# EAGLE design MidiMon_v3 (EAGLE 9.3.0)
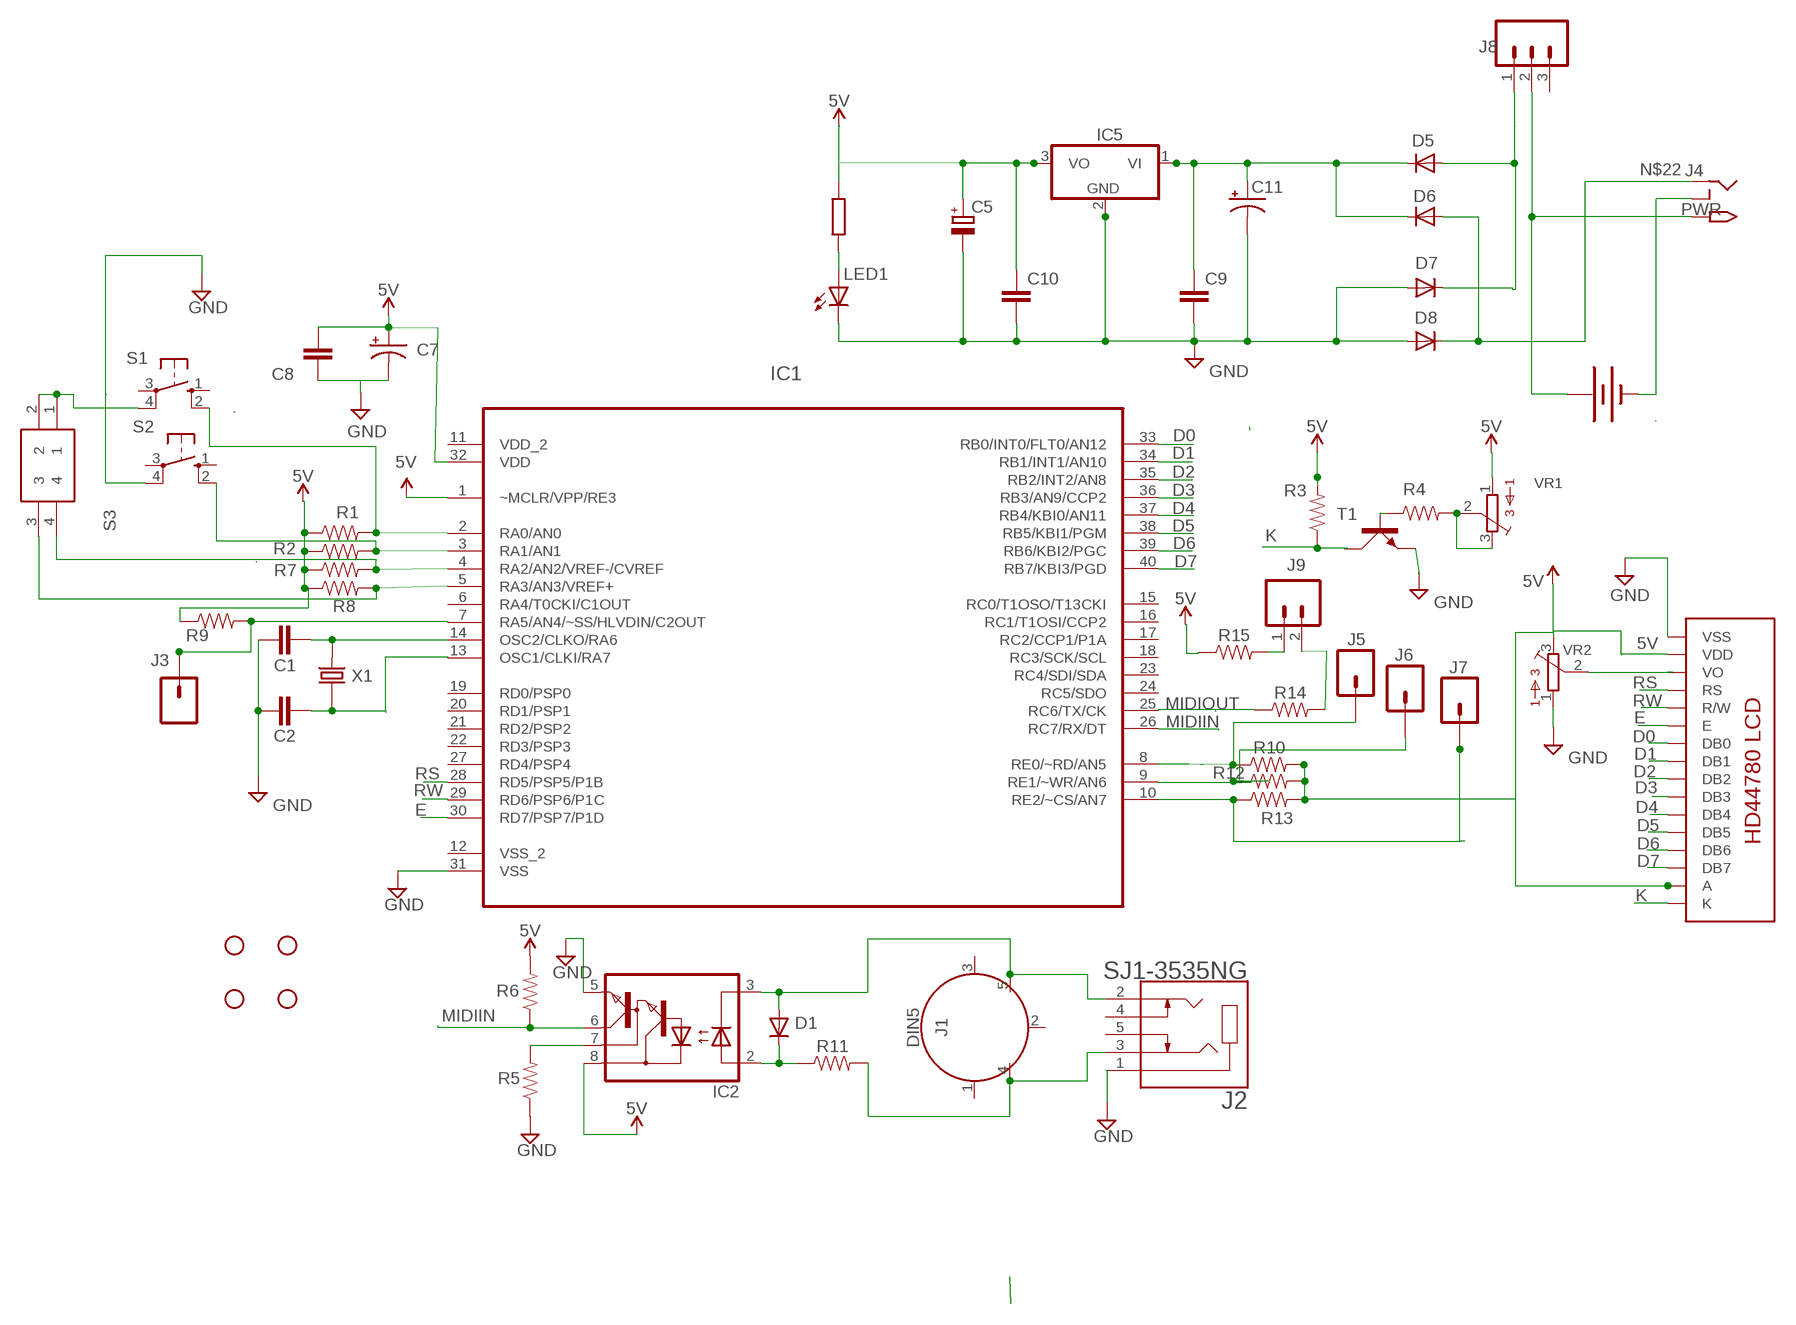
[diagram p0: schematic, sheet 1]

## Parts
BAT1  BATTERY  [PP3_BATTERBOX]
C1  33pF  22PF-PTH-2.54MM-200V-5%  [CAP-PTH-2.54]
C2  33pF  22PF-PTH-2.54MM-200V-5%  [CAP-PTH-2.54]
C5  10uf  CPOL-EUE2.5-7  [E2,5-7]
C7  10uF  10UF-POLAR-RADIAL-2.5MM-25V-20%  [CPOL-RADIAL-2.5MM-5MM]
C8  0.1uF  C-EU025-024X044  [C025-024X044]
C9  330nf  C-EU025-024X044  [C025-024X044]
C10  100nf  C-EU025-024X044  [C025-024X044]
C11  2200uf  CPOL-USE5-10.5  [E5-10,5]
D1  DIODEDO-1N4148  [DO-1N4148]
D5  1N4004  [DO-VERT]
D6  1N4004  [DO-VERT]
D7  1N4004  [DO-VERT]
D8  1N4004  [DO-VERT]
H1  STAND-OFFTIGHT  [STAND-OFF-TIGHT]
H2  STAND-OFFTIGHT  [STAND-OFF-TIGHT]
H3  STAND-OFFTIGHT  [STAND-OFF-TIGHT]
H4  STAND-OFFTIGHT  [STAND-OFF-TIGHT]
IC1  PIC18F4520-I/P  [DIP254P1524X533-40]
IC2  6N138  [DIL08]
IC5  7805TV  [TO220V]
J1  DIN5  [DIN5-RA-PTH]
J2  SJ1-3535NG  [CUI_SJ1-3535NG]
J3  CONN_01  [1X01]
J4  2.1MMJACKTHM  [PJ-102A]
J5  CONN_01  [1X01]
J6  CONN_01  [1X01]
J7  CONN_01  [1X01]
J8  CONN_03  [1X03]
J9  CONN_02  [1X02]
LED1  LED3MM  [LED3MM]
R1  10k  1KOHM-HORIZ-1/4W-5%  [AXIAL-0.3]
R2  10k  1KOHM-HORIZ-1/4W-5%  [AXIAL-0.3]
R3  10k  1KOHM-HORIZ-1/4W-5%  [AXIAL-0.3]
R4  1k  1KOHM-HORIZ-1/4W-5%  [AXIAL-0.3]
R5  5.6k  1KOHM-HORIZ-1/4W-5%  [AXIAL-0.3]
R6  1.2k  1KOHM-HORIZ-1/4W-5%  [AXIAL-0.3]
R7  10k  1KOHM-HORIZ-1/4W-5%  [AXIAL-0.3]
R8  10k  1KOHM-HORIZ-1/4W-5%  [AXIAL-0.3]
R9  10k  1KOHM-HORIZ-1/4W-5%  [AXIAL-0.3]
R10  10k  1KOHM-HORIZ-1/4W-5%  [AXIAL-0.3]
R11  220  1KOHM-HORIZ-1/4W-5%  [AXIAL-0.3]
R12  10k  1KOHM-HORIZ-1/4W-5%  [AXIAL-0.3]
R13  10k  1KOHM-HORIZ-1/4W-5%  [AXIAL-0.3]
R14  220  1KOHM-HORIZ-1/4W-5%  [AXIAL-0.3]
R15  220  1KOHM-HORIZ-1/4W-5%  [AXIAL-0.3]
R20  1k  R-EU_0207/7  [0207/7]
S1  40-XX  [B3F-40XX]
S2  40-XX  [B3F-40XX]
S3  195-2MST  [DIPS774W56P254L726H790Q4N]
T1  2N3904  [TO92D]
U$2  LCD-HD4478020X4-3HOLES  [LCD-20X4-3HOLES]
VR1  BOURNS_3362P_TRIMMERP  [BOURNS_3362P_TRIMMER]
VR2  BOURNS_3362P_TRIMMERP  [BOURNS_3362P_TRIMMER]
X1  ECS-100-18-4X  [XTAL_ECS-100-18-4X]

## Nets
5V: C5.+ C7.1(+) C8.2 C10.1 IC1.1(~MCLR/VPP/RE3) IC1.32(VDD) IC2.8(VCC) IC5.3(VO) R1.P$1 R2.P$1 R3.P$2 R6.P$2 R7.P$1 R8.P$1 R9.P$1 R10.P$2 R12.P$2 R13.P$2 R15.P$1 R20.1 U$2.P$2(VDD) U$2.P$15(A) VR1.1 VR2.3
D0: IC1.33(RB0/INT0/FLT0/AN12) U$2.P$7(DB0)
D1: IC1.34(RB1/INT1/AN10) U$2.P$8(DB1)
D2: IC1.35(RB2/INT2/AN8) U$2.P$9(DB2)
D3: IC1.36(RB3/AN9/CCP2) U$2.P$10(DB3)
D4: IC1.37(RB4/KBI0/AN11) U$2.P$11(DB4)
D5: IC1.38(RB5/KBI1/PGM) U$2.P$12(DB5)
D6: IC1.39(RB6/KBI2/PGC) U$2.P$13(DB6)
D7: IC1.40(RB7/KBI3/PGD) U$2.P$14(DB7)
E: IC1.30(RD7/PSP7/P1D) U$2.P$6(E)
GND: C1.1 C2.1 C5.- C7.2(-) C8.1 C9.2 C10.2 C11.- D7.A D8.A IC1.31(VSS) IC2.5(GND) IC5.2(GND) J2.1 LED1.K(C) R5.P$1 S1.4(P1) S2.4(P1) S3.1 S3.2 T1.E U$2.P$1(VSS) VR2.1
K: R3.P$1 T1.C U$2.P$16(K)
MIDIIN: IC1.26(RC7/RX/DT) IC2.6(VO) R6.P$1
N$1: BAT1.0V(-) J4.RING_SW
N$2: R4.P$2 VR1.2 VR1.3
N$3: IC2.7(VB) R5.P$2
N$4: D1.C IC2.2(A) R11.P$1
N$5: J1.4 J2.3 R11.P$2
N$6: D1.A IC2.3(C) J1.5 J2.2
N$7: C1.2 IC1.14(OSC2/CLKO/RA6) X1.2
N$9: C2.2 IC1.13(OSC1/CLKI/RA7) X1.1
N$10: D5.A D7.C J8.1
N$13: IC1.4(RA2/AN2/VREF-/CVREF) R7.P$2 S3.4
N$14: IC1.2(RA0/AN0) R1.P$2 S1.2(S1)
N$15: IC1.3(RA1/AN1) R2.P$2 S2.2(S1)
N$17: IC1.5(RA3/AN3/VREF+) R8.P$2 S3.3
N$19: LED1.A R20.2
N$20: IC1.7(RA5/AN4/~SS/HLVDIN/C2OUT) J3.1 R9.P$2
N$21: IC1.25(RC6/TX/CK) R14.P$1
N$22: D6.A D8.C J4.RING
N$24: U$2.P$3(VO) VR2.2
N$28: R4.P$1 T1.B
N$29: IC1.9(RE1/~WR/AN6) J6.1 R12.P$1
N$30: IC1.8(RE0/~RD/AN5) J5.1 R10.P$1
N$31: IC1.10(RE2/~CS/AN7) J7.1 R13.P$1
N$33: J9.2 R14.P$2
N$34: J9.1 R15.P$2
PWR: BAT1.9V(+) J4.TIP J8.2
RS: IC1.28(RD5/PSP5/P1B) U$2.P$4(RS)
RW: IC1.29(RD6/PSP6/P1C) U$2.P$5(R/W)
VIN: C9.1 C11.+ D5.C D6.C IC5.1(VI)
Unconnected: IC1.6(RA4/T0CKI/C1OUT) IC1.15(RC0/T1OSO/T13CKI) IC1.16(RC1/T1OSI/CCP2) IC1.17(RC2/CCP1/P1A) IC1.18(RC3/SCK/SCL) IC1.19(RD0/PSP0) IC1.20(RD1/PSP1) IC1.21(RD2/PSP2) IC1.22(RD3/PSP3) IC1.23(RC4/SDI/SDA) IC1.24(RC5/SDO) IC1.27(RD4/PSP4) J1.1 J1.2 J1.3 J2.4 J2.5 J8.3 S1.1(S) S1.3(P) S2.1(S) S2.3(P)

## Power pins joined to a net without a drawn wire
VDD_2: IC1.11(VDD_2)
VSS_2: IC1.12(VSS_2)

## Library data of the parts
BAT1 = jasons_stuff:BATTERY: Battery Holders Various common sizes : AA, AAA, 20mm coin cell and 12mm coin cell.
C1 C2 = SparkFun-Capacitors:22PF: 22pF ceramic capacitors A capacitor is a passive two-terminal electrical component used to store electrical energy temporarily in an electric field.; PROD_ID: CAP-09128; VALUE: 22pF
C5 = rcl:CPOL-EU: POLARIZED CAPACITOR, European symbol
C7 = SparkFun-Capacitors:10UF-POLAR: 10.0µF polarized capacitors A capacitor is a passive two-terminal electrical component used to store electrical energy temporarily in an electric field.; PROD_ID: CAP-08440
C8 = rcl:C-EU: CAPACITOR, European symbol; SPICEPREFIX: C
C9 C10 = rcl:C-EU: CAPACITOR, European symbol
C11 = adafruit:CPOL-US: POLARIZED CAPACITOR, American symbol
D1 = adafruit:DIODE: Diode SMADIODE - SMA Surface Mount Package 20V 1A Schottky Diode Digikey: 641-1014-6-ND DO-1N4148 - Through Hole Small Current Diode SOD-123 20V 1 A (.5mV Vf) Schottky Diode - Digikey: MBRX120TPMSCT-ND SOD-323 10V 570mA (.38mV Vf, 3ns) Schottky Diode - Digikey: ZLLS410CT-ND SOD-523 30V 30mA Schottky Diode (RB751S-40TE61) - Digikey: RB751S-40TE61CT-ND SOT23-R/W - SOT23 Package (R = Solder Paste/Reflow Ovens, W = Hand-Soldering) BAT54Film 40V 300mA - Digikey: 497-7162-1-ND
D5-D8 = jasons_stuff:1N4004: DIODE general purpose rectifier, 1 A
H1-H4 = SparkFun-Hardware:STAND-OFF: Stand Off Drill holes for mechanically mounting via screws, standoffs, etc. Note: Use the keepout ring to avoid running the screw head into surrounding components. Variant Overviews STAND-OFF - Mechanical footprint for a #4 phillips button head screw. STAND-OFF-TIGHT - Mechanical footprint for a #4 phillips button head screw, Example SparkFun Products Screw - Phillips Head (1/4", 4-40, 10 pack) <https://www.sparkfun.com/products/10453> (PRT-10453) Screw - Phillips Head (1/2", 4-40, 10 pack) <https://www.sparkfun.com/products/10452> (PRT-10452) Screw - Phillips Head (3/4", 4-40, 10 pack) <https://www.sparkfun.com/products/10451> (PRT-10451) Screw - Phillips Head (1", 4-40, 10 pack) <https://www.sparkfun.com/products/10450> (PRT-10450)
IC1 = PIC18F4520-I_P:PIC18F4520-I/P: Flash Microcontrollers; AVAILABILITY: Unavailable; DESCRIPTION: PIC18 Series 1.5 kB RAM 32 kB Flash 36 I/O 8-Bit Microcontroller - PDIP-40; MF: Microchip; MP: PIC18F4520-I/P; PACKAGE: TQFP-44 Microchip; PRICE: None
IC2 = optocoupler:6N138: MOTOROLA OPTO COUPLER; MF: VISHAY/TELEFUNKEN; MPN: 6N138; OC_FARNELL: 9860150; OC_NEWARK: 35K5294
IC5 = linear:78*: Positive VOLTAGE REGULATOR Source: http://cache.national.com/ds/LM/LM78L05.pdf http://www.fairchildsemi.com/ds/LM/LM7805.pdf
J1 = SparkFun-Connectors:DIN5: DIN5 Connector - Female Right Angle (frequently used as a MIDI Jack connector) This type of connector and cable is frequently used for transmitting midi data (musical instrument digital interface). It is what you usually see on a keyboard or set of electronic drums. Learn more here <https://en.wikipedia.org/wiki/MIDI>. For more information on the pinout and electrical specifications of MIDI communications, please see the following resource: https://www.midi.org/specifications/item/midi-din-electrical-specification Here is the connector we sell at SparkFun: MIDI Connector - Female Right Angle <https://www.sparkfun.com/products/9536> (PRT-09536) Datasheet <hhttp://www.sparkfun.com/datasheets/Prototyping/Connectors/MIDI-RA.pdf> It is used on this SparkFun product: SparkFun MIDI Shield <https://www.sparkfun.com/products/12898> (DEV-12898); PROD_ID: CONN-09481
J2 = SJ1-3535NG:SJ1-3535NG: SJ1 Series 3.5 mm 12 V Right Angle Through Hole Isolated Stereo Audio Jack; AVAILABILITY: Unavailable; CUI_PURCHASE_URL: https://www.cui.com/product/interconnect/audio-connectors/3.5-mm-jacks/sj1-353xng-series?utm_source=snapeda.com&utm_medium=referral&utm_campaign=snapedaBOM; DESCRIPTION: SJ1 Series 3.5 mm 12 V Right Angle Through Hole Isolated Stereo Audio Jack; MF: CUI Inc.; MP: SJ1-3535NG; PACKAGE: None; PRICE: None
J3 J5-J7 = SparkFun-Connectors:CONN_01: Single connection point. Often used as Generic Header-pin footprint for 0.1 inch spaced/style header connections On any of the 0.1 inch spaced packages, you can populate with these: Break Away Headers - Straight <https://www.sparkfun.com/products/116> (PRT-00116) Break Away Male Headers - Right Angle <https://www.sparkfun.com/products/553> (PRT-00553) Female Headers <https://www.sparkfun.com/products/115> (PRT-00115) Break Away Headers - Machine Pin <https://www.sparkfun.com/products/117> (PRT-00117) Break Away Female Headers - Swiss Machine Pin <https://www.sparkfun.com/products/743> (PRT-00743) This device is also useful as a general connection point to wire up your design to another part of your project. Our various solder wires solder well into these plated through hole pads. Hook-Up Wire - Assortment (Stranded, 22 AWG) <https://www.sparkfun.com/products/11375> (PRT-11375) Hook-Up Wire - Assortment (Solid Core, 22 AWG) <https://www.sparkfun.com/products/11367> (PRT-11367) View the entire wire category on our website here <https://www.sparkfun.com/categories/141> Special notes: SMTSO-256-ET is a "flush mount" nut for a 4-40 screw. We mostly use this on specialty testbeds; it is a nice way to connect hardware to your PCB at an adjustable hieght. Also note, the SNAP packages are for using a snappable style connector. We sell a baggie of snaps and they are also used on two LilyPad designs: Snap Assortment - 30 pack (male and female) <https://www.sparkfun.com/products/11347> (DEV-11347) LilyPad Arduino SimpleSnap <https://www.sparkfun.com/products/10941> (DEV-10941) LilyPad SimpleSnap Protoboard <https://www.sparkfun.com/products/10940> (DEV-10940)
J4 = adafruit:2.1MMJACK: 2.1mm x 5.5mm THM DC jack with internal switch. Digikey part #PJ-102A, 4UCON part #05537 2.1mm x 5.5mm SMT DC jack with internal switch. Digikey part #PJ-002A-SMT, 4UCON part #03267 By microbuilder.eu & adafruit.com
J8 = SparkFun-Connectors:CONN_03: Multi connection point. Often used as Generic Header-pin footprint for 0.1 inch spaced/style header connections On any of the 0.1 inch spaced packages, you can populate with these: Break Away Headers - Straight <https://www.sparkfun.com/products/116> (PRT-00116) Break Away Male Headers - Right Angle <https://www.sparkfun.com/products/553> (PRT-00553) Female Headers <https://www.sparkfun.com/products/115> (PRT-00115) Break Away Headers - Machine Pin <https://www.sparkfun.com/products/117> (PRT-00117) Break Away Female Headers - Swiss Machine Pin <https://www.sparkfun.com/products/743> (PRT-00743) Stackable Header - 3 Pin (Female, 0.1") <https://www.sparkfun.com/products/13875> (PRT-13875) For SCREWTERMINALS and SPRING TERMINALS visit here: Screw Terimnals on SparkFun.com <https://www.sparkfun.com/search/results?term=Screw+Terminals> (5mm/3.5mm/2.54mm spacing) This device is also useful as a general connection point to wire up your design to another part of your project. Our various solder wires solder well into these plated through hole pads. Hook-Up Wire - Assortment (Stranded, 22 AWG) <https://www.sparkfun.com/products/11375> (PRT-11375) Hook-Up Wire - Assortment (Solid Core, 22 AWG) <https://www.sparkfun.com/products/11367> (PRT-11367) View the entire wire category on our website here <https://www.sparkfun.com/categories/141> Special notes: Molex polarized connector foot print use with SKU : PRT-08232 with associated crimp pins and housings.
J9 = SparkFun-Connectors:CONN_02: Multi connection point. Often used as Generic Header-pin footprint for 0.1 inch spaced/style header connections On any of the 0.1 inch spaced packages, you can populate with these: Break Away Headers - Straight <https://www.sparkfun.com/products/116> (PRT-00116) Break Away Male Headers - Right Angle <https://www.sparkfun.com/products/553> (PRT-00553) Female Headers <https://www.sparkfun.com/products/115> (PRT-00115) Break Away Headers - Machine Pin <https://www.sparkfun.com/products/117> (PRT-00117) Break Away Female Headers - Swiss Machine Pin <https://www.sparkfun.com/products/743> (PRT-00743) For SCREWTERMINALS and SPRING TERMINALS visit here: Screw Terimnals on SparkFun.com <https://www.sparkfun.com/search/results?term=Screw+Terminals> (5mm/3.5mm/2.54mm spacing) This device is also useful as a general connection point to wire up your design to another part of your project. Our various solder wires solder well into these plated through hole pads. Hook-Up Wire - Assortment (Stranded, 22 AWG) <https://www.sparkfun.com/products/11375> (PRT-11375) Hook-Up Wire - Assortment (Solid Core, 22 AWG) <https://www.sparkfun.com/products/11367> (PRT-11367) View the entire wire category on our website here <https://www.sparkfun.com/categories/141> Special notes: Molex polarized connector foot print use with: PRT-08233 with associated crimp pins and housings. 2.54_SCREWTERM for use with PRT-10571. 3.5mm Screw Terminal footprints for PRT-08084 5mm Screw Terminal footprints for use with PRT-08432
LED1 = adafruit:LED: LED OSRAM: - CHIPLED LG R971, LG N971, LY N971, LG Q971, LY Q971, LO R971, LY R971 LH N974, LH R974 LS Q976, LO Q976, LY Q976 LO Q996 - Hyper CHIPLED LW Q18S LB Q993, LB Q99A, LB R99A - SideLED LS A670, LO A670, LY A670, LG A670, LP A670 LB A673, LV A673, LT A673, LW A673 LH A674 LY A675 LS A676, LA A676, LO A676, LY A676, LW A676 LS A679, LY A679, LG A679 - Hyper Micro SIDELED® LS Y876, LA Y876, LO Y876, LY Y876 LT Y87S - SmartLED LW L88C, LW L88S LB L89C, LB L89S, LG L890 LS L89K, LO L89K, LY L89K LS L896, LA L896, LO L896, LY L896 - TOPLED LS T670, LO T670, LY T670, LG T670, LP T670 LSG T670, LSP T670, LSY T670, LOP T670, LYG T670 LG T671, LOG T671, LSG T671 LB T673, LV T673, LT T673, LW T673 LH T674 LS T676, LA T676, LO T676, LY T676, LB T676, LH T676, LSB T676, LW T676 LB T67C, LV T67C, LT T67C, LS T67K, LO T67K, LY T67K, LW E67C LS E67B, LA E67B, LO E67B, LY E67B, LB E67C, LV E67C, LT E67C LW T67C LS T679, LY T679, LG T679 LS T770, LO T770, LY T770, LG T770, LP T770 LB T773, LV T773, LT T773, LW T773 LH T774 LS E675, LA E675, LY E675, LS T675 LS T776, LA T776, LO T776, LY T776, LB T776 LHGB T686 LT T68C, LB T68C - Hyper Mini TOPLED® LB M676 - Mini TOPLED Santana® LG M470 LS M47K, LO M47K, LY M47K Source: http://www.osram.convergy.de/
R1-R3 R5-R15 = SparkFun-Resistors:1KOHM: 1kΩ resistor A resistor is a passive two-terminal electrical component that implements electrical resistance as a circuit element. Resistors act to reduce current flow, and, at the same time, act to lower voltage levels within circuits. - Wikipedia; PROD_ID: RES-08380; VALUE: 1k
R4 = SparkFun-Resistors:1KOHM: 1kΩ resistor A resistor is a passive two-terminal electrical component that implements electrical resistance as a circuit element. Resistors act to reduce current flow, and, at the same time, act to lower voltage levels within circuits. - Wikipedia; PROD_ID: RES-08380
R20 = rcl:R-EU_: RESISTOR, European symbol
S1 S2 = adafruit:40-XX: OMRON SWITCH; MF: OMRON COMPONENTS USA; MPN: B3F-4000; OC_FARNELL: 176434; OC_NEWARK: 36K3105
S3 = SamacSys_Parts:195-2MST: Switch DIP OFF ON SPST 2 Piano 0.05A 24VDC PC Pins 2.54mm Thru-Hole Tube Source: Datasheet <https://componentsearchengine.com/Datasheets/1/195-2MST.pdf>; DESCRIPTION: Switch DIP OFF ON SPST 2 Piano 0.05A 24VDC PC Pins 2.54mm Thru-Hole Tube; HEIGHT: 7.9mm; MANUFACTURER_NAME: CTS; MANUFACTURER_PART_NUMBER: 195-2MST; MOUSER_PART_NUMBER: 774-1952MST
T1 = transistor-small-signal:2N3904: NPN TRANSISTOR
U$2 = HD44780LCD:LCD-HD44780
VR1 VR2 = MusicThingModular:BOURNS_3362P_TRIMMER: 3362 Series 1/4" Square Trimmer
X1 = ECS-100-18-4X:ECS-100-18-4X: CRYSTAL T/H; DESCRIPTION: Crystal 10MHz ±30ppm _Tol_ ±50ppm _Stability_ 18pF FUND 60Ohm 2-Pin HC-49/USX Thru-Hole; DIGI-KEY_PART_NUMBER: X1080-ND; DIGI-KEY_PURCHASE_URL: https://www.digikey.ca/product-detail/en/ecs-inc/ECS-100-18-4X/X1080-ND/827571?utm_source=snapeda&utm_medium=aggregator&utm_campaign=symbol; MF: ECS Inc.; MP: ECS-100-18-4X; PACKAGE: HC49/US ECS International

## Net classes
0 default: width 0.508 mm, drill 0.508 mm, clearance 0.508 mm

## Board
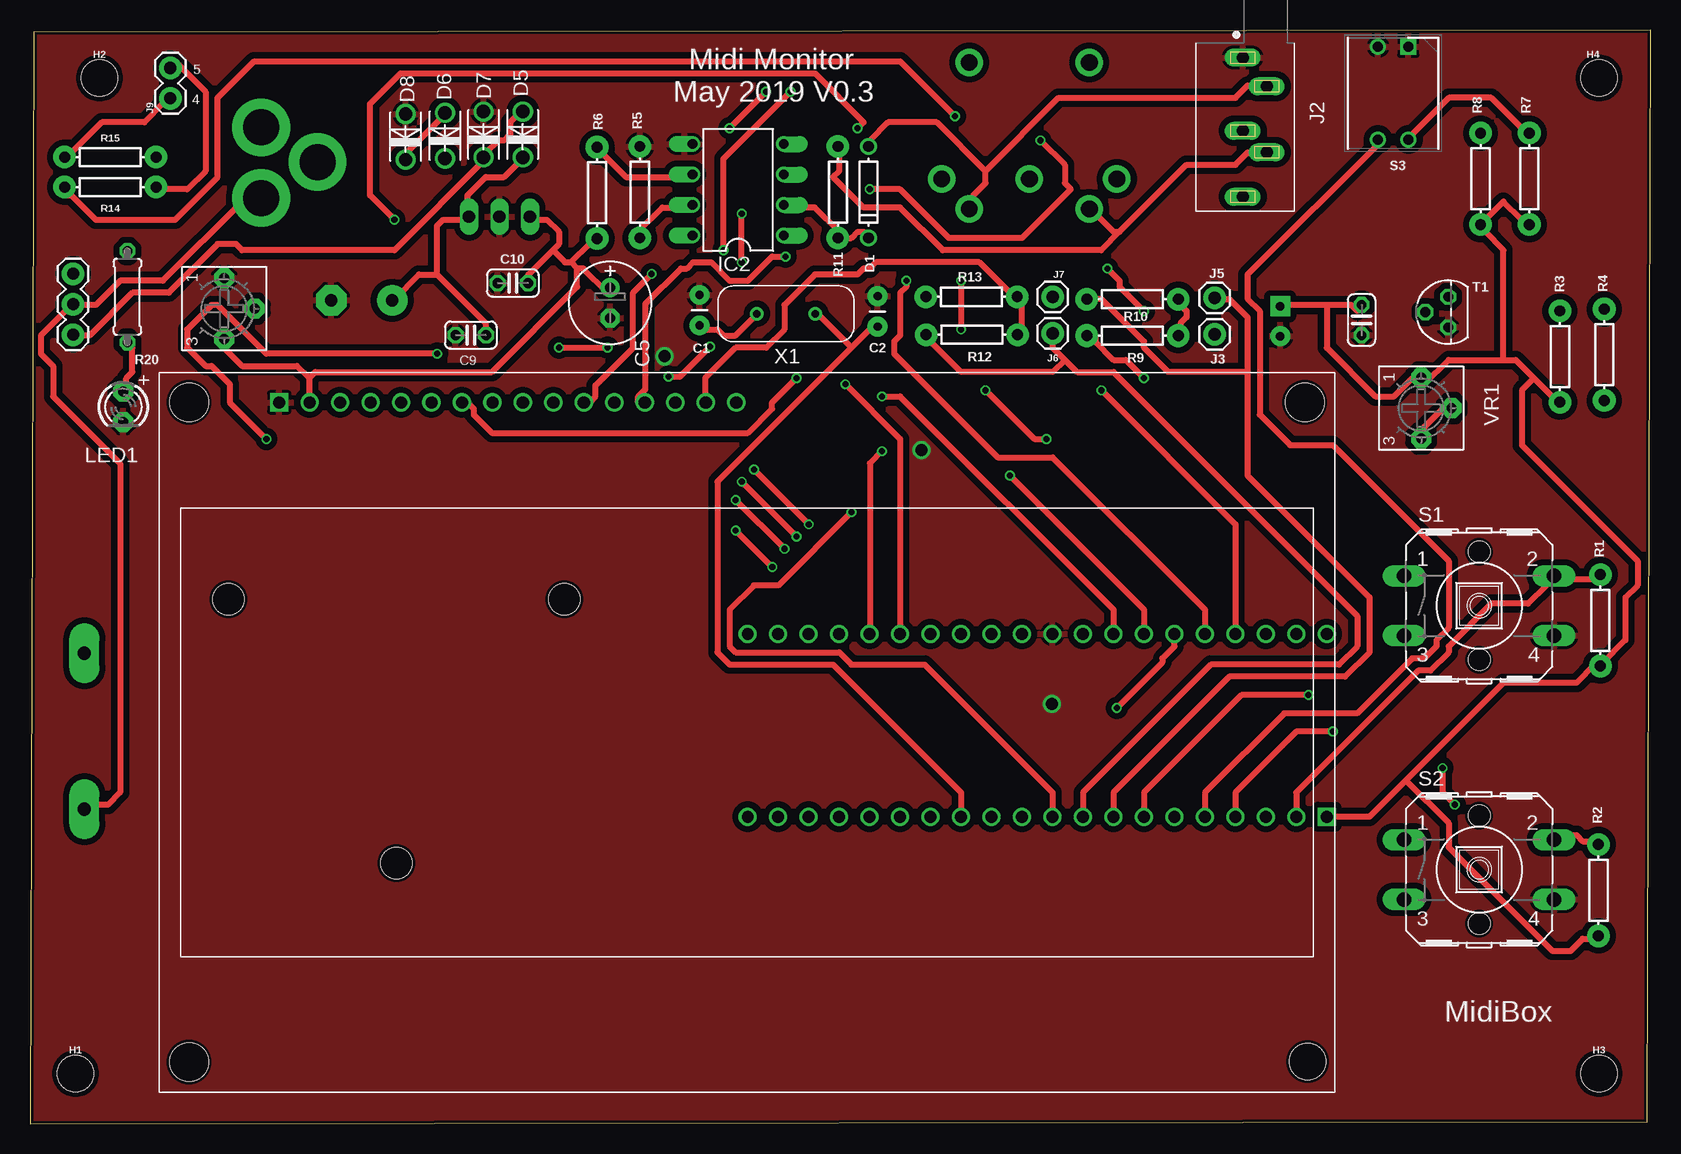
[diagram p1: board, top side]
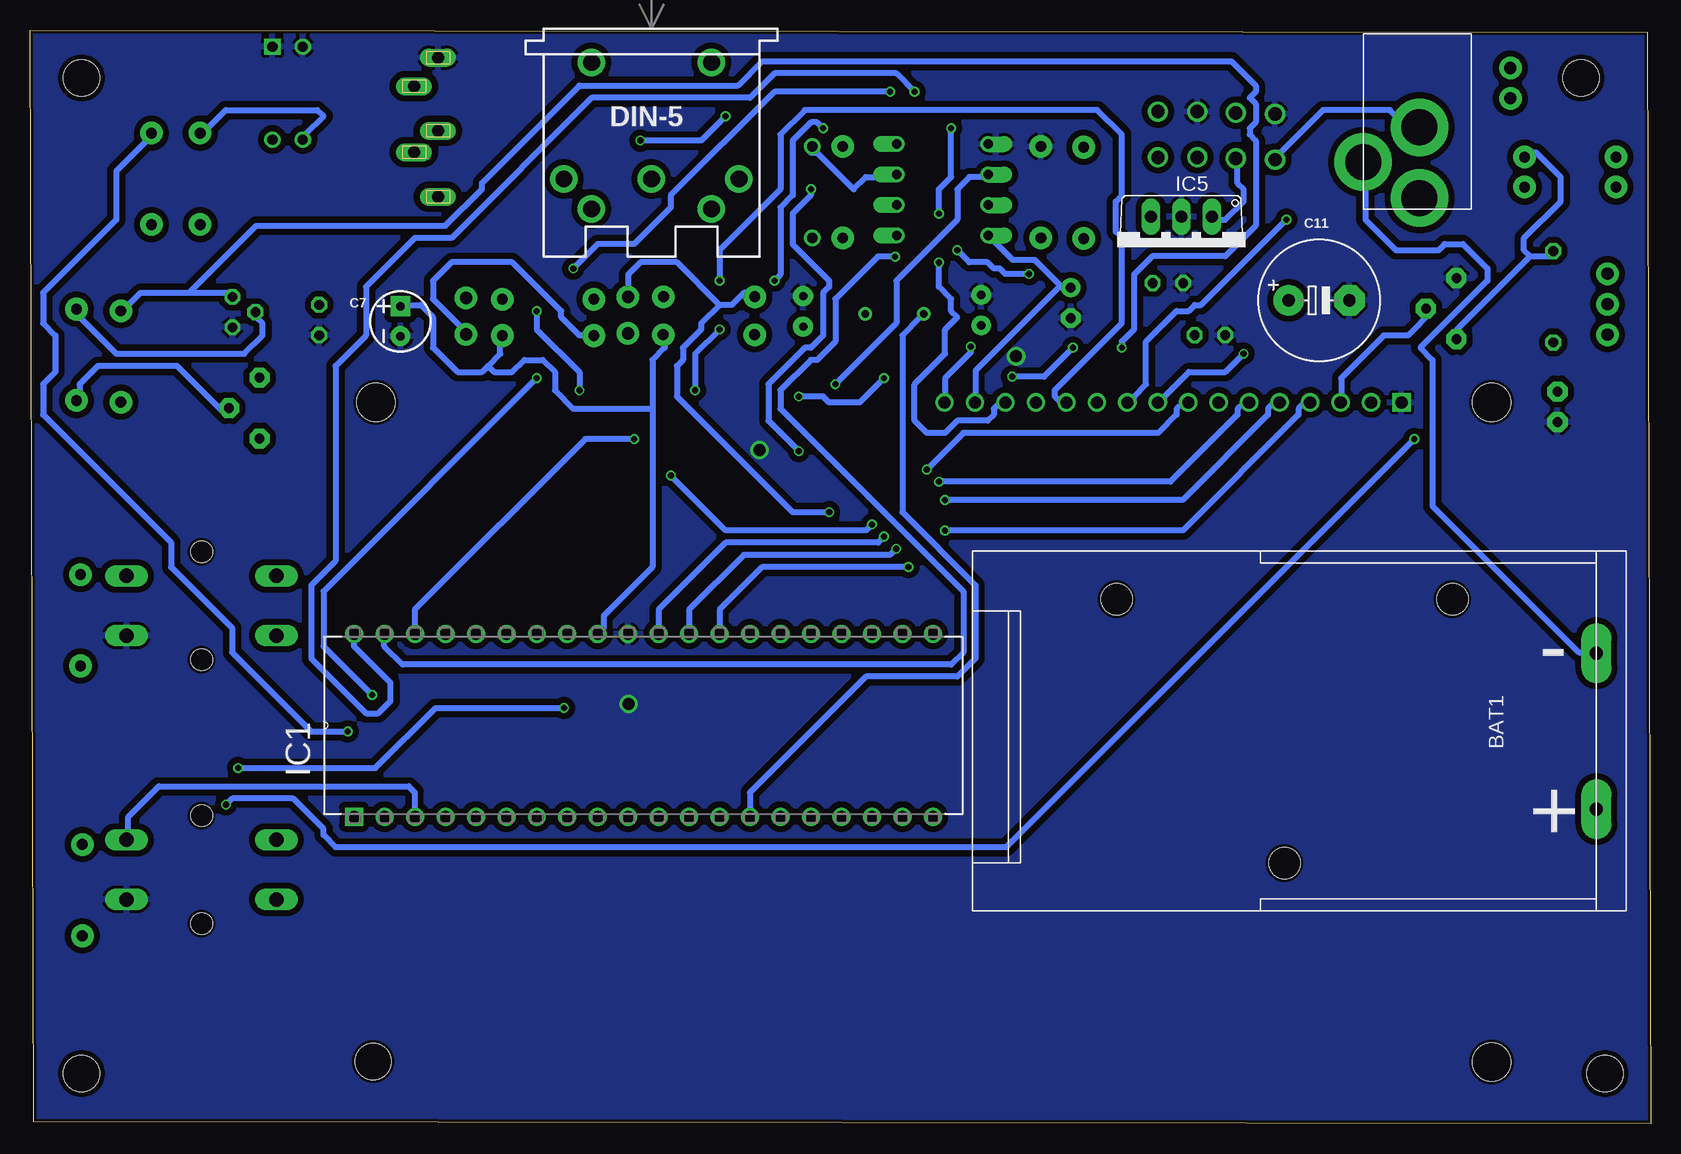
[diagram p2: board, bottom side, seen from below]

Size 135.1 x 91.2 mm. Coordinates in mm from the lower left corner, seen from the top.
Outline: 0,0 134.8,0.2 135.1,91.2 0.3,91 0,0
Copper layers (1*16): Top 0.035mm / dielectric 1.5mm / Bottom 0.035mm
Design rules "dirt_cheap_dirty_boards.v1.1": minimum track width 6mil, minimum drill 12mil, track to track 6mil, track to pad 6mil, pad to pad 6mil, via to via 6mil, smd to smd 0mil, copper to edge 10mil, drill to drill 10mil, minimum pad ring 10mil, minimum via ring 6mil, stop-mask expansion 2mil, vias tented up to drill 25mil, thermal gap 10mil
Holes 3 mm at 106.5,5.2

### Footprints (pad centres in the part's own frame; a part is rotated, then mirrored left to right if it is on the bottom)
PP3_BATTERBOX = drill 1.1 pad 2.5 long: 0V 52,21.5; 9V 52,8.5 | hole 2.6: 12,26; 40,26; 26,4
CAP-PTH-2.54 = drill 0.7 pad 1.651: 1 -1.27,0; 2 1.27,0
E2,5-7 = drill 0.813 pad 1.6: + -1.27,0 | drill 0.813 pad 1.6 octagon: - 1.27,0
CPOL-RADIAL-2.5MM-5MM = drill 0.7 pad 1.651 square: 1 1.25,0 | drill 0.7 pad 1.651: 2 -1.25,0
C025-024X044 = drill 0.813 octagon: 1 -1.27,0; 2 1.27,0
E5-10,5 = drill 1.016 pad 2.54: + -2.54,0 | drill 1.016 pad 2.54 octagon: - 2.54,0
DO-1N4148 = drill 0.9: A -3.81,0; C 3.81,0
DO-VERT = drill 1.118: A 2.54,0; C -1.27,0
STAND-OFF-TIGHT = hole 3.048: 0,0
DIP254P1524X533-40 = drill 0.991 square: 1 -15.24,48.26 | drill 0.991: 2 -15.24,45.72; 3 -15.24,43.18; 4 -15.24,40.64; 5 -15.24,38.1; 6 -15.24,35.56; 7 -15.24,33.02; 8 -15.24,30.48; 9 -15.24,27.94; 10 -15.24,25.4; 11 -15.24,22.86; 12 -15.24,20.32; 13 -15.24,17.78; 14 -15.24,15.24; 15 -15.24,12.7; 16 -15.24,10.16; 17 -15.24,7.62; 18 -15.24,5.08; 19 -15.24,2.54; 20 -15.24,0; 21 0,0; 22 0,2.54; 23 0,5.08; 24 0,7.62; 25 0,10.16; 26 0,12.7; 27 0,15.24; 28 0,17.78; 29 0,20.32; 30 0,22.86; 31 0,25.4; 32 0,27.94; 33 0,30.48; 34 0,33.02; 35 0,35.56; 36 0,38.1; 37 0,40.64; 38 0,43.18; 39 0,45.72; 40 0,48.26
DIL08 = drill 0.813 offset: 1 -3.81,-3.81; 2 -1.27,-3.81; 3 1.27,-3.81; 4 3.81,-3.81; 5 3.81,3.81; 6 1.27,3.81; 7 -1.27,3.81; 8 -3.81,3.81
TO220V = drill 1.016 long: 1 -2.54,-2.54; 2 0,-2.54; 3 2.54,-2.54
DIN5-RA-PTH = drill 1.4 pad 2.286: 1 7.3,12.5; 2 0,12.5; 3 -7.3,12.5; 4 5,15; 5 -5,15; 6 -5,2.8; 7 5,2.8
CUI_SJ1-3535NG = drill 1 long: 1 0,0; 2 2.4,2; 3 7.9,2; 4 11.6,0; 5 6.1,0
1X01 = drill 1.016 pad 1.88: 1 0,0
PJ-102A = drill 3 pad 4.8: RING 0.1,-3.39; RING_SW -4.6,-6.29; TIP 0.1,-9.29
1X03 = drill 1.016 pad 1.88: 1 0,0; 2 2.54,0; 3 5.08,0
1X02 = drill 1.016 pad 1.88: 1 0,0; 2 2.54,0
LED3MM = drill 0.813 pad 1.676 octagon: A -1.27,0; K 1.27,0
AXIAL-0.3 = drill 0.9 pad 1.88: P$1 -3.81,0; P$2 3.81,0
0207/7 = drill 0.813 octagon: 1 -3.81,0; 2 3.81,0
B3F-40XX = drill 1.194 long: 1 -6.248,2.489; 2 6.248,2.489; 3 -6.248,-2.489; 4 6.248,-2.489 | hole 1.803: 0,-4.496; 0,4.496
DIPS774W56P254L726H790Q4N = drill 0.85 pad 1.275 square: 1 0,0 | drill 0.85 pad 1.275: 2 0,-2.54; 3 7.745,-2.54; 4 7.745,0
TO92D = drill 0.813 octagon: B 0,1.905; C 1.27,0; E -1.27,0
LCD-20X4-3HOLES = drill 1.016 square: P$1 10,57.5 | drill 1.016: P$2 12.54,57.5; P$3 15.08,57.5; P$4 17.62,57.5; P$5 20.16,57.5; P$6 22.7,57.5; P$7 25.24,57.5; P$8 27.78,57.5; P$9 30.32,57.5; P$10 32.86,57.5; P$11 35.4,57.5; P$12 37.94,57.5; P$13 40.48,57.5; P$14 43.02,57.5; P$15 45.56,57.5; P$16 48.1,57.5 | hole 3.2: 2.5,2.5; 2.5,57.5; 95.5,57.5
BOURNS_3362P_TRIMMER = drill 0.813 pad 1.676 octagon: 1 -2.54,0; 2 0,2.54; 3 2.54,0
XTAL_ECS-100-18-4X = drill 0.63 pad 1.03: 1 -2.44,0; 2 2.44,0

### Placement (x,y rotation side)
BAT1  56.53,17.75 0 bottom
C1  55.81,67.84 270 top
C2  70.65,67.74 270 top
C5  48.35,68.45 270 top
C7  104.22,66.92 90 bottom
C8  111,67.02 90 top
C9  36.75,65.76 180 top
C10  40.25,70.1 180 top
C11  27.65,68.66 0 bottom
D1  69.89,77.68 270 top
D5  41.08,81.86 90 top
D6  34.59,81.76 90 top
D7  37.8,81.86 90 top
D8  31.31,81.66 90 top
H1  3.8,4.2 0 top
H2  5.8,87.2 0 top
H3  130.8,4.2 0 top
H4  130.8,87.2 0 top
IC1  59.83,40.85 90 bottom
IC2  59.03,77.88 90 top
IC5  39.13,73.09 180 bottom
J1  83.3,91.29 180 bottom
J2  101.1,88.9 270 top
J3  98.75,65.83 0 top
J4  19.37,86.48 0 bottom
J5  98.75,68.87 0 top
J6  85.25,65.91 0 top
J7  85.25,68.95 0 top
J8  3.6,65.8 90 top
J9  11.7,85.5 90 top
LED1  7.77,59.78 270 top
R1  130.9,41.99 90 top
R2  130.74,19.49 90 top
R3  127.53,63.98 270 top
R4  131.23,64.12 270 top
R5  50.84,77.68 270 top
R6  47.27,77.62 270 top
R7  124.98,78.79 90 top
R8  120.92,78.79 90 top
R9  91.91,65.72 180 top
R10  91.91,68.76 0 top
R11  67.35,77.68 90 top
R12  78.51,65.8 0 top
R13  78.49,68.96 0 top
R14  6.7,78.1 0 top
R15  6.7,80.6 180 top
R20  8.12,68.96 270 top
S1  120.8,43.2 0 top
S2  120.8,21.2 0 top
S3  114.9,89.8 270 top
T1  118.22,67.68 90 top
U$2  10.77,2.65 0 top
VR1  115.97,59.68 270 top
VR2  16.19,67.97 270 top
X1  63.03,67.54 180 top

### Tracks (layer width: path | path; a pad name or v marks a point on that pad's centre or on a via)
5V
  Top 0.508: 43.58,72.84 44.09,73.35 44.09,74.37 43.08,75.38 42.06,75.38 IC5.3 | 43.58,72.84 41.55,70.81 41.55,70.3 C10.1 | 45.11,71.83 46.63,73.35 47.14,73.35 R6.P$2 | 45.11,71.83 44.6,71.83 43.58,72.84 | 45.62,71.32 45.11,71.83 | 45.62,71.32 46.12,71.32 48.16,69.29 C5.+ | 23.26,62.18 23.26,60.65 U$2.P$2 | 23.26,62.18 22.25,63.19 17.68,63.19 15.64,65.22 16.15,65.73 VR2.3 | 45.62,71.32 45.62,69.8 38.5,62.68 23.77,62.68 23.26,62.18 | 114.7,28.65 122.83,36.78 128.93,36.78 130.45,38.3 R1.P$1 130.96,38.3 132.99,40.33 132.99,43.89 134.01,44.9 134.01,46.94 124.36,56.59 124.36,61.16 125.37,62.18 | 114.7,28.65 111.66,25.6 IC1.1 | 114.7,28.65 118.26,25.09 118.26,23.06 126.9,14.42 128.42,14.42 129.44,15.44 130.45,15.44 R2.P$1 | R12.P$2 82.7,66.24 82.7,68.78 R13.P$2 82.19,68.78 81.68,68.78 81.68,69.29 79.14,71.83 70.51,71.83 70,71.32 69.49,71.32 68.98,70.81 65.43,70.81 62.89,68.27 62.89,66.24 61.36,64.72 58.82,64.72 56.28,62.18 56.28,60.65 U$2.P$15 | R7.P$1 124.86,74.88 124.36,74.88 124.36,75.38 122.83,76.91 121.31,75.38 R8.P$1 121.31,74.88 121.31,74.37 122.83,72.84 122.83,63.7 | R9.P$1 95.91,65.73 95.91,66.75 96.42,67.26 96.42,67.76 95.91,68.27 R10.P$2 | 108.1,68.27 110.13,68.27 110.64,67.76 111.15,68.27 C8.2 | 108.1,68.27 104.54,68.27 C7.1 | 115.72,62.18 115.21,62.18 113.69,60.65 112.16,60.65 108.1,64.72 108.1,68.27 | 125.37,62.18 123.85,63.7 122.83,63.7 | 125.37,62.18 126.9,60.65 127.4,60.65 R3.P$2 | 122.83,63.7 118.26,63.7 116.23,61.67 115.72,62.18 | 115.72,62.18 VR1.1
  Bottom 0.508: U$2.P$15 56.28,60.65 56.28,62.78 49.27,69.8 48.43,69.8 C5.+ 49.03,69.72 51.34,72.03 53.18,72.03 IC2.8 | 10.06,72.34 8.53,72.34 R20.1 | 10.06,72.34 16.15,66.24 15.64,65.73 15.64,65.22 16.15,65.22 VR2.3 | 10.06,72.34 10.56,72.84 10.56,73.86 7.52,76.91 7.52,78.94 9.55,80.97 10.06,80.97 R15.P$1 | 83.21,59.64 83.21,63.7 82.19,64.72 82.19,65.73 R12.P$2 | 83.21,59.64 83.21,46.43 87.27,42.36 87.27,41.35 IC1.32 | 96.92,63.19 97.43,62.68 99.46,62.68 101.5,64.72 101.5,67.26 102.51,68.27 104.04,68.27 C7.1 | 96.92,63.19 95.91,64.21 95.91,65.22 R9.P$1 | 83.21,59.64 89.81,59.64 91.34,61.16 91.34,62.68 92.35,63.7 93.88,63.7 94.89,62.68 96.42,62.68 96.92,63.19
D0  (via drill 0.51)
  Top 0.508: v71.02,60.65 72.54,60.65 90.32,42.87 90.32,41.35 IC1.33 | v63.9,62.18 61.87,60.14 61.87,59.64 59.84,57.6 38.5,57.6 36.98,59.13 36.98,59.64 36.47,60.14 U$2.P$7
  Bottom 0.508: v71.02,60.65 68.98,60.65 68.48,60.14 65.94,60.14 v63.9,62.18
D1  (via drill 0.51)
  Top 0.508: v81.68,54.05 92.86,42.87 92.86,41.35 IC1.34 | v60.35,54.56 v64.92,49.98
  Bottom 0.508: v81.68,54.05 77.11,49.48 65.43,49.48 v64.92,49.98 | v60.35,54.56 57.3,57.6 41.04,57.6 39.52,59.13 39.52,59.64 39.01,60.14 U$2.P$8
D2  (via drill 0.51)
  Top 0.508: v90.59,34.68 94.38,38.47 94.38,38.81 95.4,39.82 IC1.35 | v117.75,29.66 117.75,27.63 v118.77,26.62 | v19.71,57.1 16.66,60.14 16.66,61.67 15.14,63.19 14.63,63.19 13.1,64.72 13.1,66.24 15.14,68.27 15.64,68.27 19.71,64.21 v33.93,64.21
  Bottom 0.508: v117.75,29.66 106.32,29.66 101.3,34.68 v90.59,34.68 | v118.77,26.62 118.26,27.12 113.18,27.12 110.64,24.58 110.64,24.08 109.62,23.06 53.74,23.06 v19.71,57.1 | v33.93,64.21 35.46,62.68 38.5,62.68 40.54,60.65 40.54,60.14 41.04,60.14 U$2.P$9
D3  (via drill 0.51)
  Top 0.508: v73.05,70.3 73.05,69.8 72.54,69.29 72.54,65.73 72.03,65.22 72.03,64.21 80.67,55.57 85.24,55.57 97.94,42.87 97.94,41.35 IC1.36 | v68.98,83 69.49,83.51 65.43,87.58 30.88,87.58 28.34,85.04 28.34,77.42 v30.38,75.38
  Bottom 0.508: v73.05,70.3 72.54,70.81 72.54,76.4 71.52,77.42 71.52,81.99 70,83.51 69.49,83.51 v68.98,83 | v30.38,75.38 37.49,68.27 38,68.27 38.5,67.76 39.52,67.76 42.06,65.22 42.06,61.67 43.08,60.65 43.08,60.14 43.58,60.14 U$2.P$10
D4  (via drill 0.51)
  Top 0.508: v89.3,61.16 100.48,49.98 100.48,41.35 IC1.37 | v92.86,67.76 90.83,69.8 90.83,70.3 v89.81,71.32 | v63.4,86.05 57.81,80.46 v57.81,72.84 | v51.83,70.86 50.28,69.32 50.28,64.7 47.14,61.56 47.14,60.65 46.63,60.14 U$2.P$11
  Bottom 0.508: v89.3,61.16 89.3,62.68 92.86,66.24 v92.86,67.76 | v89.81,71.32 87.78,73.35 84.73,73.35 81.68,76.4 81.68,77.42 73.05,86.05 v63.4,86.05 | v57.81,72.84 56.79,71.83 55.27,71.83 54.76,71.32 54.25,71.32 53.8,70.86 v51.83,70.86
D5  (via drill 0.51)
  Top 0.508: v84.73,57.1 83.72,57.1 v79.65,61.16 | v77.62,70.3 v77.62,66.24
  Bottom 0.508: v84.73,57.1 88.8,57.1 103.02,42.87 103.02,41.35 IC1.38 | v79.65,61.16 79.65,64.21 v77.62,66.24 | v77.62,70.3 77.62,72.84 72.54,77.92 72.54,82.5 70.51,84.53 46.12,84.53 44.09,82.5 44.09,77.42 44.6,76.91 44.6,74.37 44.09,73.86 44.09,66.75 49.68,61.16 49.68,60.65 49.17,60.14 U$2.P$12
D6  (via drill 0.51)
  Top 0.508: v62.98,72.3 61.86,72.32 59.84,70.3 58.32,70.3 56.79,71.83 55.27,71.83 54.76,71.32 54.25,71.32 51.3,68.37 51.3,61.26 50.7,60.65 50.7,60.14 51.2,60.14 U$2.P$13
  Bottom 0.508: v62.98,72.3 64.43,72.32 67.97,68.78 67.97,65.22 69.49,63.7 70,63.7 72.54,61.16 72.54,59.64 57.3,44.4 57.3,39.32 58.32,38.3 104.04,38.3 105.56,39.82 IC1.39
D7  (via drill 0.51)
  Top 0.508: v58.32,83 v61.36,86.05 | v59.33,71.83 v59.33,75.89
  Bottom 0.508: v61.36,86.05 62.89,87.58 73.05,87.58 75.08,85.54 88.29,85.54 99.97,73.86 103.02,73.86 107.08,69.8 107.08,65.73 109.62,63.19 109.62,46.94 111.66,44.9 111.66,38.81 107.08,34.24 106.07,34.24 105.05,35.25 105.05,36.78 108.1,39.82 IC1.40 | v58.32,83 58.32,78.94 59.33,77.92 v59.33,75.89 | v59.33,71.83 59.33,69.8 58.32,68.78 58.32,67.76 57.81,67.26 58.82,66.24 58.82,64.21 61.36,61.67 61.36,58.62 60.35,57.6 58.82,57.6 57.81,58.62 55.27,58.62 54.76,59.13 54.76,59.64 54.25,60.14 U$2.P$14
E  (via drill 0.51)
  Top 0.508: v59.33,53.54 v63.9,48.97
  Bottom 0.508: v63.9,48.97 64.41,48.46 77.11,48.46 82.7,42.87 82.7,41.35 IC1.30 | v59.33,53.54 40.03,53.54 34.44,59.13 34.44,59.64 33.93,60.14 U$2.P$6
GND  (via drill 1, 1.02)
  other vias: 85.2,35 74.3,56.2 52.9,64
  pour Top: -15.2,108.2 164.8,108.2 164.8,-5.8 -15.2,-5.8
  pour Bottom: -15.2,108.2 164.8,108.2 164.8,-5.8 -15.2,-5.8
K  (via drill 0.51)
  Top 0.508: v56.68,64.81 54.18,62.3 v53.23,62.3 | v44.09,64.72 v48.16,64.72
  Bottom 0.508: 121.82,69.29 125.88,69.29 126.9,68.27 126.9,67.76 127.4,67.76 R3.P$1 | 121.82,69.29 118.26,69.29 T1.C | v56.68,64.81 56.68,64.32 58.82,62.18 58.82,60.65 U$2.P$16 | v53.23,62.3 50.57,62.3 v48.16,64.72 | v44.09,64.72 44.09,65.22 43.08,66.24 43.08,70.81 41.55,72.34 35.46,72.34 32.92,74.88 32.92,81.99 33.42,82.5 33.42,83 32.92,83.51 32.92,85.04 33.42,85.54 32.92,86.05 32.92,86.56 34.95,88.59 74.06,88.59 76.1,86.56 89.3,86.56 97.43,78.43 97.43,77.92 100.48,74.88 116.23,74.88 121.82,69.29
MIDIIN  (via drill 0.51)
  Top 0.508: IC2.6 54.76,78.94 49.68,78.94 47.65,80.97 R6.P$1 | v67.97,61.67 72.54,57.1 72.54,41.35 IC1.26
  Bottom 0.508: v67.97,61.67 62.89,66.75 62.89,70.3 57.81,75.38 57.81,77.92 56.79,78.94 55.27,78.94 IC2.6
N$1
  Bottom 0.508: BAT1.0V 4.87,39.32 5.99,39.32 18.18,51.51 18.18,63.7 19.2,64.72 13.61,70.3 13.61,71.32 15.64,73.35 17.17,73.35 17.68,72.84 21.23,72.84 23.77,75.38 23.77,79.96 J4.RING_SW
N$2
  Top 0.508: VR1.3 116.23,57.6 116.23,58.11 118.26,60.14 VR1.2
  Bottom 0.508: R4.P$2 130.96,60.65 130.96,61.67 129.44,63.19 122.83,63.19 118.77,59.13 118.26,59.64 VR1.2
N$3
  Top 0.508: IC2.7 54.76,76.4 52.73,76.4 50.7,74.37 R5.P$2
N$4
  Top 0.508: IC2.2 62.89,76.4 65.43,76.4 67.46,74.37 R11.P$1 67.46,73.86 68.48,73.86 68.98,74.37 69.49,74.37 D1.C
N$5
  Top 0.508: 90.83,74.37 96.42,79.96 100.48,79.96 101.5,80.97 103.02,80.97 J2.3 | 90.83,74.37 90.32,74.37 88.8,75.89 J1.4 | 90.83,74.37 89.3,72.84 76.1,72.84 72.54,76.4 69.49,76.4 66.95,78.94 67.46,79.45 67.46,81.48 R11.P$2
N$6
  Top 0.508: 79.65,79.45 85.75,85.54 100.48,85.54 101.5,86.56 103.02,86.56 J2.2 | 79.65,79.45 79.65,78.43 78.64,77.42 78.64,76.4 J1.5 | 79.65,79.45 75.59,83.51 71.52,83.51 70,81.99 D1.A
  Bottom 0.508: IC2.3 62.89,78.94 65.43,78.94 66.44,77.92 69.49,80.97 70,80.97 70,81.48 D1.A
N$7
  Top 0.508: X1.2 60.35,67.26 58.82,65.73 57.81,65.73 57.3,66.24 56.28,66.24 C1.2
  Bottom 0.508: IC1.14 75.08,26.11 75.08,27.63 65.43,37.28 57.81,37.28 56.28,38.81 56.28,44.9 62.38,51 62.38,65.73 60.86,67.26 X1.2
N$9
  Top 0.508: 68.48,64.72 65.94,67.26 X1.1 | 68.48,64.72 70.51,66.75 C2.2 | 68.48,64.72 57.3,53.54 57.3,39.32 58.32,38.3 66.95,38.3 77.62,27.63 77.62,26.11 IC1.13
N$10
  Top 0.508: D5.A 41.04,84.53 40.54,84.53 40.54,84.02 40.03,83.51 40.03,82.5 39.52,81.99 39.01,81.99 38,80.97 D7.C 38,80.46 30.38,72.84 17.68,72.84 17.17,73.35 15.64,73.35 11.58,69.29 8.53,69.29 4.98,65.73 3.96,65.73 J8.1
N$13  (via drill 0.51)
  Top 0.508: S3.4 115.21,82.5 118.26,85.54 121.82,85.54 124.36,83 124.36,82.5 124.86,82.5 R7.P$2 | v108.61,32.71 105.56,32.71 100.48,27.63 100.48,26.11 IC1.4
  Bottom 0.508: v108.61,32.71 111.66,32.71 118.26,39.32 118.26,41.35 123.34,46.43 123.34,48.46 134.01,59.13 134.01,61.67 132.99,62.68 132.99,65.73 134.01,66.75 134.01,69.29 127.91,75.38 127.91,79.45 125.37,81.99 124.86,81.99 124.86,82.5 R7.P$2
N$14
  Top 0.508: IC1.2 105.56,26.11 105.56,27.63 115.72,37.79 116.74,37.79 118.26,39.32 118.26,39.82 121.82,43.38 124.86,43.38 126.39,44.9 126.39,45.41 126.9,45.92 S1.2 127.4,45.41 130.45,45.41 R1.P$2
N$15
  Top 0.508: R2.P$2 130.45,23.57 129.44,23.57 128.93,24.08 127.4,24.08 S2.2
  Bottom 0.508: IC1.3 103.02,26.11 103.02,27.63 103.53,28.14 124.36,28.14 126.9,25.6 126.9,24.08 S2.2
N$17
  Top 0.508: IC1.5 97.94,26.11 97.94,27.63 104.54,34.24 110.64,34.24 115.21,38.81 116.23,38.81 117.24,39.82 117.24,40.33 118.26,41.35 118.26,46.94 108.61,56.59 105.05,56.59 102.51,59.13 102.51,67.76 101.5,68.78 101.5,70.81 112.67,81.99 S3.3
  Bottom 0.508: S3.3 112.16,82.5 110.64,84.02 111.15,84.53 118.77,84.53 120.29,83 120.29,82.5 120.8,82.5 R8.P$2
N$19
  Top 0.508: R20.2 8.53,64.72 8.53,62.68 8.02,62.18 8.02,61.16 LED1.A
N$20  (via drill 0.51)
  Top 0.508: v106.58,35.76 100.99,35.76 92.86,27.63 92.86,26.11 IC1.7 | v92.86,62.18 91.34,63.7 90.32,63.7 88.8,65.22 88.8,65.73 88.29,66.24 87.78,65.73 R9.P$2
  Bottom 0.508: v106.58,35.76 110.64,39.82 110.64,44.4 v92.86,62.18 | J3.1 98.96,66.24 101.5,68.78 101.5,70.3 99.97,71.83 94.89,71.83 90.83,67.76 90.83,67.26 89.3,65.73 88.29,65.73 R9.P$2
N$21  (via drill 0.51)
  Top 0.508: v71.02,56.08 70,55.06 70,41.35 IC1.25 | v70,77.92 72.54,77.92 76.6,73.86 82.7,73.86 86.76,77.92 86.26,78.43 86.26,79.96 v84.22,81.99 | v77.11,84.02 72.54,88.59 18.69,88.59 15.64,85.54 15.64,78.94 12.09,75.38 5.48,75.38 3.45,77.42 2.94,77.42 2.44,77.92 R14.P$1
  Bottom 0.508: v71.02,56.08 73.56,58.62 73.56,61.67 70.51,64.72 70,64.72 68.98,65.73 68.98,69.29 68.48,69.8 68.48,70.3 71.52,73.35 71.52,75.89 70,77.42 v70,77.92 | v84.22,81.99 79.14,81.99 v77.11,84.02
N$22
  Top 0.508: D8.C 31.39,80.46 31.39,80.97 34.44,84.02 D6.A
  Bottom 0.508: D8.C 30.88,80.46 30.88,80.97 27.33,84.53 21.74,84.53 20.72,83.51 19.71,83.51 J4.RING
N$24
  Bottom 0.508: U$2.P$3 25.8,60.65 25.8,62.18 22.25,65.73 20.22,65.73 18.18,67.76 18.69,68.27 VR2.2
N$28
  Bottom 0.508: T1.B 116.23,67.26 115.72,66.75 115.72,65.73 117.24,64.21 127.91,64.21 131.47,67.76 R4.P$1
N$29
  Top 0.508: 86.26,63.7 85.24,64.72 85.24,65.73 J6.1 | 86.26,63.7 87.27,62.68 90.32,62.68 110.64,42.36 110.64,39.82 109.12,38.3 98.45,38.3 87.78,27.63 87.78,26.11 IC1.9 | 86.26,63.7 85.24,62.68 77.62,62.68 75.08,65.22 75.08,65.73 R12.P$1
N$30
  Top 0.508: 101.5,62.68 101.5,67.26 99.97,68.78 99.46,68.78 98.96,68.27 98.45,68.78 J5.1 | 101.5,62.68 101.5,54.05 111.66,43.89 111.66,39.32 109.62,37.28 99.97,37.28 90.32,27.63 90.32,26.11 IC1.8 | 101.5,62.68 94.89,62.68 92.86,64.72 92.86,65.22 89.3,68.78 88.29,68.78 R10.P$1
N$31  (via drill 0.51)
  Top 0.508: v68.48,51 62.38,44.9 60.35,44.9 58.32,42.87 58.32,39.82 58.82,39.32 67.46,39.32 68.48,38.3 74.57,38.3 85.24,27.63 85.24,26.11 IC1.10
  Bottom 0.508: v68.48,51 71.52,51 81.18,60.65 81.18,63.19 80.67,63.7 80.67,64.72 79.14,66.24 79.14,66.75 77.62,68.27 | 77.62,68.27 76.6,68.27 75.59,69.29 75.08,69.29 R13.P$1 | 77.62,68.27 81.18,71.83 84.22,71.83 85.24,70.81 85.24,69.29 J7.1
N$33
  Top 0.508: R14.P$2 10.56,77.92 13.1,77.92 14.63,79.45 14.63,86.05 12.09,88.59 11.58,88.08 J9.2
N$34
  Top 0.508: R15.P$2 2.94,80.97 3.45,80.97 5.99,83.51 9.55,83.51 11.07,85.04 11.07,85.54 11.58,85.54 J9.1
PWR
  Top 0.508: J4.TIP 19.2,76.91 17.68,76.91 11.07,70.3 7.52,70.3 5.48,68.27 3.96,68.27 J8.2 3.45,68.78 2.94,68.27 2.94,67.76 0.91,65.73 0.91,64.21 1.93,63.19 1.93,60.65 7.52,55.06 7.52,27.63 6.5,26.62 4.87,26.62 BAT1.9V
RS  (via drill 0.51)
  Top 0.508: v58.82,49.48 v61.87,46.43
  Bottom 0.508: v61.87,46.43 74.06,46.43 77.62,42.87 77.62,41.35 IC1.28 | v58.82,49.48 39.01,49.48 29.36,59.13 29.36,59.64 28.85,60.14 U$2.P$4
RW  (via drill 0.51)
  Top 0.508: v58.82,52.02 v62.89,47.95
  Bottom 0.508: v62.89,47.95 63.4,47.44 75.59,47.44 80.16,42.87 80.16,41.35 IC1.29 | v58.82,52.02 39.01,52.02 31.9,59.13 31.9,59.64 31.39,60.14 U$2.P$5
VIN
  Top 0.508: 33.93,70.81 38,66.75 38,66.24 C9.1 | 33.93,70.81 32.41,70.81 30.38,68.78 C11.+ | 33.93,70.81 33.93,74.88 34.44,75.38 36.47,75.38 IC5.1 36.47,75.89 36.47,77.42 38,78.94 39.52,78.94 41.04,80.46 D5.C
  Bottom 0.508: D6.C 34.44,80.46 34.44,78.43 33.93,77.92 33.93,76.91 35.46,75.38 36.47,75.38 IC5.1

### Text on the board
tPlace: Midi Monitor | 5 | 4 | May 2019 V0.3 | MidiBox